# Altium project 48FE+2GE+2SFP.PrjPcb (part 6 of 9)

## Sheet 26_PP0_SSMII.SchDoc
size 419 x 296 mm; Author: Serbinov O.A.; CompanyName: ELSICOM; DrawnBy: Serbinov O.A.; Engineer: Serbinov O.A.; Organization: Elsicom; Address1: Kirova avenue, 58; Address2: Tomsk; Address3: Russia 634012; DocumentNumber: 27; SheetNumber: 27; SheetTotal: 44; ProjectName: 48_PORTS
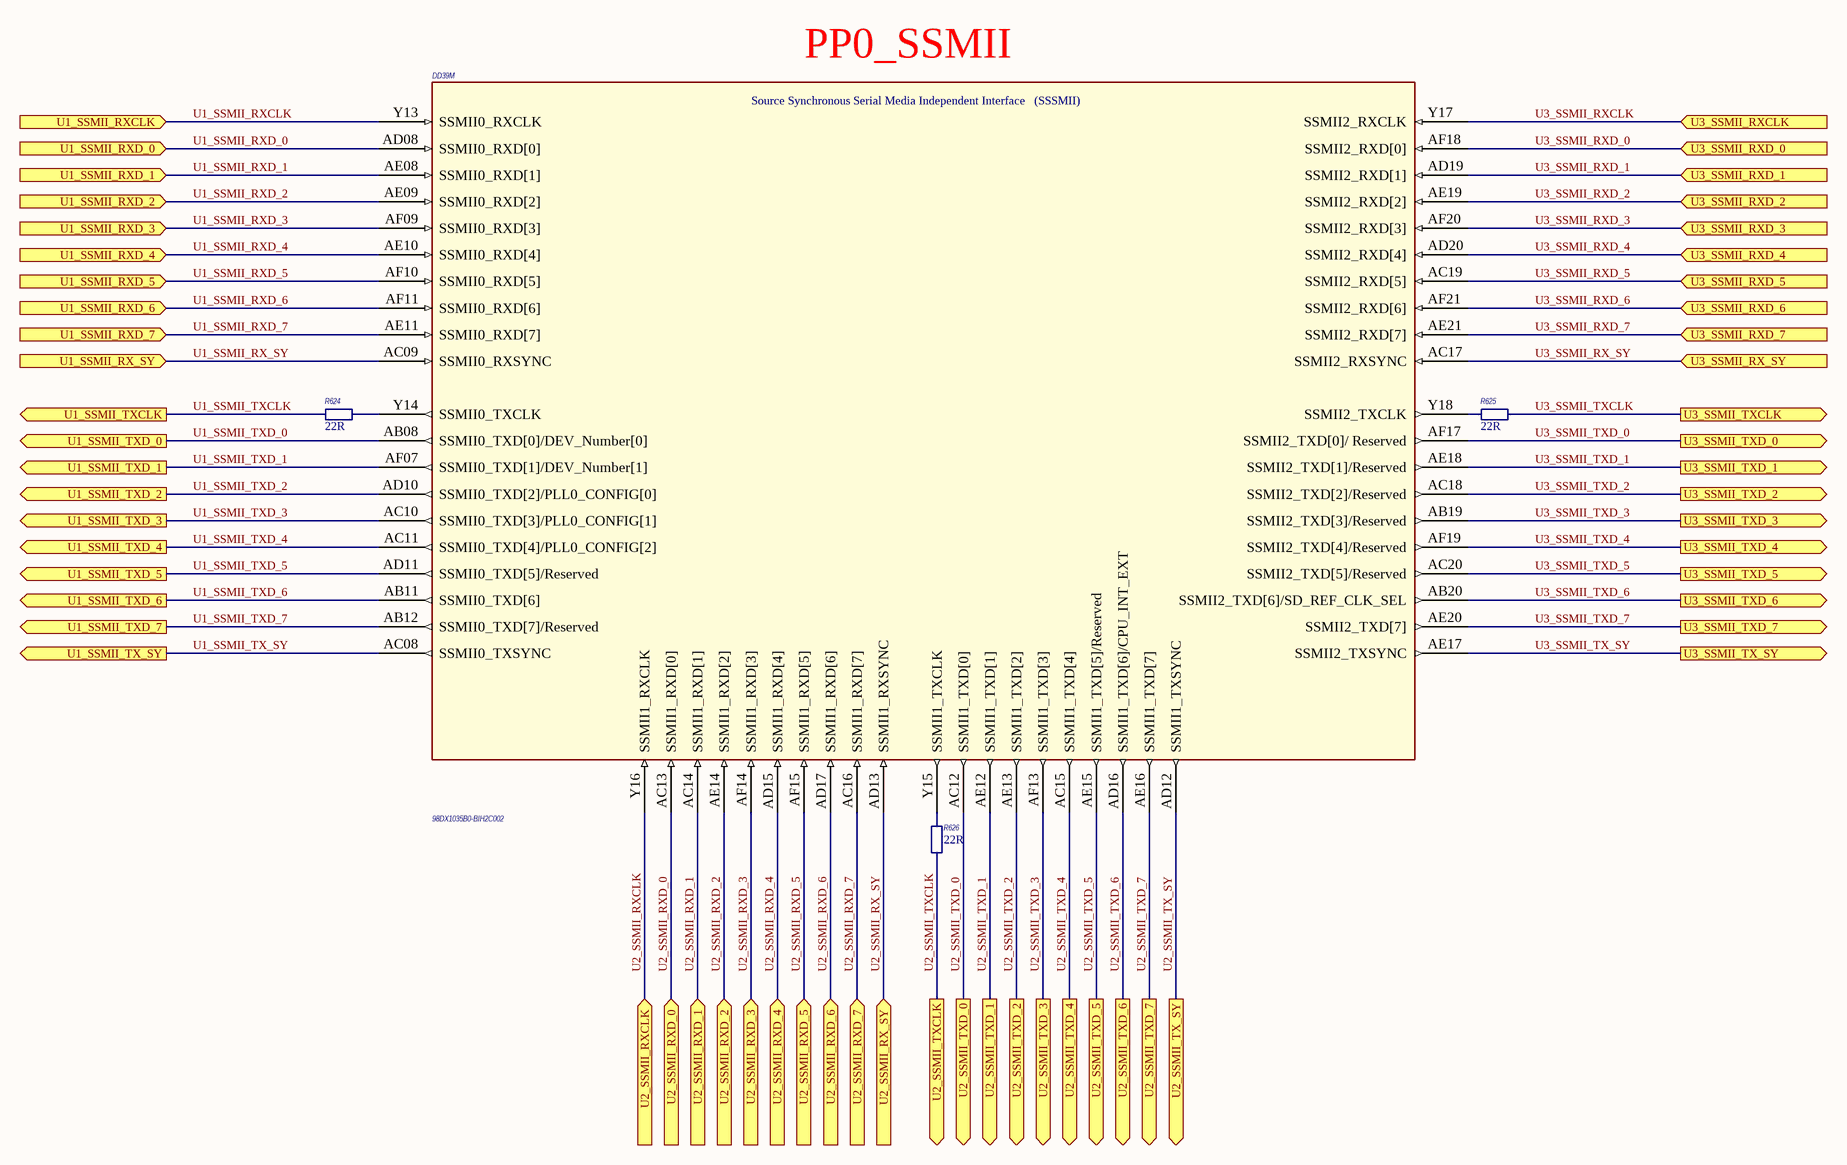
[diagram p14: 26_PP0_SSMII.SchDoc]

### Parts
DD39  98DX1035B0-BIH2C002  [HSBGA617_27X27_1MM]  (part M of 16)
R624  Resistance: 22R  [R0402_IPC High Density]  (hidden comment: ERJ-2RKF22R0X)
R625  Resistance: 22R  [R0402_IPC High Density]  (hidden comment: ERJ-2RKF22R0X)
R626  Resistance: 22R  [R0402_IPC High Density]  (hidden comment: ERJ-2RKF22R0X)

### Ports
U1_SSMII_RX_SY (in), U1_SSMII_RXCLK (in), U1_SSMII_RXD_0 (in), U1_SSMII_RXD_1 (in), U1_SSMII_RXD_2 (in), U1_SSMII_RXD_3 (in), U1_SSMII_RXD_4 (in), U1_SSMII_RXD_5 (in), U1_SSMII_RXD_6 (in), U1_SSMII_RXD_7 (in), U1_SSMII_TX_SY (out), U1_SSMII_TXCLK (out), U1_SSMII_TXD_0 (out), U1_SSMII_TXD_1 (out), U1_SSMII_TXD_2 (out), U1_SSMII_TXD_3 (out), U1_SSMII_TXD_4 (out), U1_SSMII_TXD_5 (out), U1_SSMII_TXD_6 (out), U1_SSMII_TXD_7 (out), U2_SSMII_RX_SY (in), U2_SSMII_RXCLK (in), U2_SSMII_RXD_0 (in), U2_SSMII_RXD_1 (in), U2_SSMII_RXD_2 (in), U2_SSMII_RXD_3 (in), U2_SSMII_RXD_4 (in), U2_SSMII_RXD_5 (in), U2_SSMII_RXD_6 (in), U2_SSMII_RXD_7 (in), U2_SSMII_TX_SY (out), U2_SSMII_TXCLK (out), U2_SSMII_TXD_0 (out), U2_SSMII_TXD_1 (out), U2_SSMII_TXD_2 (out), U2_SSMII_TXD_3 (out), U2_SSMII_TXD_4 (out), U2_SSMII_TXD_5 (out), U2_SSMII_TXD_6 (out), U2_SSMII_TXD_7 (out), U3_SSMII_RX_SY (in), U3_SSMII_RXCLK (in), U3_SSMII_RXD_0 (in), U3_SSMII_RXD_1 (in), U3_SSMII_RXD_2 (in), U3_SSMII_RXD_3 (in), U3_SSMII_RXD_4 (in), U3_SSMII_RXD_5 (in), U3_SSMII_RXD_6 (in), U3_SSMII_RXD_7 (in), U3_SSMII_TX_SY (out), U3_SSMII_TXCLK (out), U3_SSMII_TXD_0 (out), U3_SSMII_TXD_1 (out), U3_SSMII_TXD_2 (out), U3_SSMII_TXD_3 (out), U3_SSMII_TXD_4 (out), U3_SSMII_TXD_5 (out), U3_SSMII_TXD_6 (out), U3_SSMII_TXD_7 (out)

### Nets
U1_SSMII_RX_SY: DD39.AC09(SSMII0_RXSYNC) ; port U1_SSMII_RX_SY
U1_SSMII_RXCLK: DD39.Y13(SSMII0_RXCLK) ; port U1_SSMII_RXCLK
U1_SSMII_RXD_0: DD39.AD08(SSMII0_RXD[0]) ; port U1_SSMII_RXD_0
U1_SSMII_RXD_1: DD39.AE08(SSMII0_RXD[1]) ; port U1_SSMII_RXD_1
U1_SSMII_RXD_2: DD39.AE09(SSMII0_RXD[2]) ; port U1_SSMII_RXD_2
U1_SSMII_RXD_3: DD39.AF09(SSMII0_RXD[3]) ; port U1_SSMII_RXD_3
U1_SSMII_RXD_4: DD39.AE10(SSMII0_RXD[4]) ; port U1_SSMII_RXD_4
U1_SSMII_RXD_5: DD39.AF10(SSMII0_RXD[5]) ; port U1_SSMII_RXD_5
U1_SSMII_RXD_6: DD39.AF11(SSMII0_RXD[6]) ; port U1_SSMII_RXD_6
U1_SSMII_RXD_7: DD39.AE11(SSMII0_RXD[7]) ; port U1_SSMII_RXD_7
U1_SSMII_TX_SY: DD39.AC08(SSMII0_TXSYNC) ; port U1_SSMII_TX_SY
U1_SSMII_TXCLK: R624.2 ; port U1_SSMII_TXCLK
U1_SSMII_TXD_0: DD39.AB08(SSMII0_TXD[0]/DEV_Number[0]) ; port U1_SSMII_TXD_0
U1_SSMII_TXD_1: DD39.AF07(SSMII0_TXD[1]/DEV_Number[1]) ; port U1_SSMII_TXD_1
U1_SSMII_TXD_2: DD39.AD10(SSMII0_TXD[2]/PLL0_CONFIG[0]) ; port U1_SSMII_TXD_2
U1_SSMII_TXD_3: DD39.AC10(SSMII0_TXD[3]/PLL0_CONFIG[1]) ; port U1_SSMII_TXD_3
U1_SSMII_TXD_4: DD39.AC11(SSMII0_TXD[4]/PLL0_CONFIG[2]) ; port U1_SSMII_TXD_4
U1_SSMII_TXD_5: DD39.AD11(SSMII0_TXD[5]/Reserved) ; port U1_SSMII_TXD_5
U1_SSMII_TXD_6: DD39.AB11(SSMII0_TXD[6]) ; port U1_SSMII_TXD_6
U1_SSMII_TXD_7: DD39.AB12(SSMII0_TXD[7]/Reserved) ; port U1_SSMII_TXD_7
U2_SSMII_RX_SY: DD39.AD13(SSMII1_RXSYNC) ; port U2_SSMII_RX_SY
U2_SSMII_RXCLK: DD39.Y16(SSMII1_RXCLK) ; port U2_SSMII_RXCLK
U2_SSMII_RXD_0: DD39.AC13(SSMII1_RXD[0]) ; port U2_SSMII_RXD_0
U2_SSMII_RXD_1: DD39.AC14(SSMII1_RXD[1]) ; port U2_SSMII_RXD_1
U2_SSMII_RXD_2: DD39.AE14(SSMII1_RXD[2]) ; port U2_SSMII_RXD_2
U2_SSMII_RXD_3: DD39.AF14(SSMII1_RXD[3]) ; port U2_SSMII_RXD_3
U2_SSMII_RXD_4: DD39.AD15(SSMII1_RXD[4]) ; port U2_SSMII_RXD_4
U2_SSMII_RXD_5: DD39.AF15(SSMII1_RXD[5]) ; port U2_SSMII_RXD_5
U2_SSMII_RXD_6: DD39.AD17(SSMII1_RXD[6]) ; port U2_SSMII_RXD_6
U2_SSMII_RXD_7: DD39.AC16(SSMII1_RXD[7]) ; port U2_SSMII_RXD_7
U2_SSMII_TX_SY: DD39.AD12(SSMII1_TXSYNC) ; port U2_SSMII_TX_SY
U2_SSMII_TXCLK: R626.2 ; port U2_SSMII_TXCLK
U2_SSMII_TXD_0: DD39.AC12(SSMII1_TXD[0]) ; port U2_SSMII_TXD_0
U2_SSMII_TXD_1: DD39.AE12(SSMII1_TXD[1]) ; port U2_SSMII_TXD_1
U2_SSMII_TXD_2: DD39.AE13(SSMII1_TXD[2]) ; port U2_SSMII_TXD_2
U2_SSMII_TXD_3: DD39.AF13(SSMII1_TXD[3]) ; port U2_SSMII_TXD_3
U2_SSMII_TXD_4: DD39.AC15(SSMII1_TXD[4]) ; port U2_SSMII_TXD_4
U2_SSMII_TXD_5: DD39.AE15(SSMII1_TXD[5]/Reserved) ; port U2_SSMII_TXD_5
U2_SSMII_TXD_6: DD39.AD16(SSMII1_TXD[6]/CPU_INT_EXT) ; port U2_SSMII_TXD_6
U2_SSMII_TXD_7: DD39.AE16(SSMII1_TXD[7]) ; port U2_SSMII_TXD_7
U3_SSMII_RX_SY: DD39.AC17(SSMII2_RXSYNC) ; port U3_SSMII_RX_SY
U3_SSMII_RXCLK: DD39.Y17(SSMII2_RXCLK) ; port U3_SSMII_RXCLK
U3_SSMII_RXD_0: DD39.AF18(SSMII2_RXD[0]) ; port U3_SSMII_RXD_0
U3_SSMII_RXD_1: DD39.AD19(SSMII2_RXD[1]) ; port U3_SSMII_RXD_1
U3_SSMII_RXD_2: DD39.AE19(SSMII2_RXD[2]) ; port U3_SSMII_RXD_2
U3_SSMII_RXD_3: DD39.AF20(SSMII2_RXD[3]) ; port U3_SSMII_RXD_3
U3_SSMII_RXD_4: DD39.AD20(SSMII2_RXD[4]) ; port U3_SSMII_RXD_4
U3_SSMII_RXD_5: DD39.AC19(SSMII2_RXD[5]) ; port U3_SSMII_RXD_5
U3_SSMII_RXD_6: DD39.AF21(SSMII2_RXD[6]) ; port U3_SSMII_RXD_6
U3_SSMII_RXD_7: DD39.AE21(SSMII2_RXD[7]) ; port U3_SSMII_RXD_7
U3_SSMII_TX_SY: DD39.AE17(SSMII2_TXSYNC) ; port U3_SSMII_TX_SY
U3_SSMII_TXCLK: R625.1 ; port U3_SSMII_TXCLK
U3_SSMII_TXD_0: DD39.AF17(SSMII2_TXD[0]/_Reserved) ; port U3_SSMII_TXD_0
U3_SSMII_TXD_1: DD39.AE18(SSMII2_TXD[1]/Reserved) ; port U3_SSMII_TXD_1
U3_SSMII_TXD_2: DD39.AC18(SSMII2_TXD[2]/Reserved) ; port U3_SSMII_TXD_2
U3_SSMII_TXD_3: DD39.AB19(SSMII2_TXD[3]/Reserved) ; port U3_SSMII_TXD_3
U3_SSMII_TXD_4: DD39.AF19(SSMII2_TXD[4]/Reserved) ; port U3_SSMII_TXD_4
U3_SSMII_TXD_5: DD39.AC20(SSMII2_TXD[5]/Reserved) ; port U3_SSMII_TXD_5
U3_SSMII_TXD_6: DD39.AB20(SSMII2_TXD[6]/SD_REF_CLK_SEL) ; port U3_SSMII_TXD_6
U3_SSMII_TXD_7: DD39.AE20(SSMII2_TXD[7]) ; port U3_SSMII_TXD_7
NetDD39_Y14: DD39.Y14(SSMII0_TXCLK) R624.1
NetDD39_Y15: DD39.Y15(SSMII1_TXCLK) R626.1
NetDD39_Y18: DD39.Y18(SSMII2_TXCLK) R625.2

### Notes on the sheet
- (near DD39) PP0_SSMII
- A3
- SIZE
- PROJECT
- SHEET
- OF
- Engineer: Oleg Serbinov
- (in symbol 98DX1035A1-BIH2C002, part M) Source Synchronous Serial Media Independent Interface   (SSSMII)

### Library data of the parts
DD39 = 98DX1035A1-BIH2C002: IC 24-PORT FE  4-PORT 2.5GE L2 ENTRY-LEVEL, CPU; Customer Part Number: Микросхема, 98DX1035B0-BIH2C002, IC 24-PORT FE 4-PORT 2.5GE L2 ENTRY-LEVEL, HSBGA617SBGA617; Manufacturer: Marvell Technology Group; Manufacturer Part Number: 98DX1035B0-BIH2C002
R624-R626 = ERJ-2RKF22R0X: R0402, 22R 1%; Manufacturer: Panasonic; Rpart number: RC0402FR-0749R9L ; RC1005F49R9CS ; MCR01MRTF49R9 ; CRCW040249R9FKED ; CR0402-FX-49R9GLF ; RC-02W220FT; Rmanufacturer: Yageo  Samsung  Stackpole Electronics  Rohm Semiconductor  Vishay Dale; Customer Part Number: Резистор, 22R, 0402, 1%; Power Rating: 100; Voltage Rating: 50; Temperature Coefficient: ± 100; Resistor Element Material: Thick Film; Resistor Case Style: 0402; Resistor Mounting: SMD; Analogs: any suitable; Supplier 1: Farnell; Supplier Part Number 1: 2059106; RoHS 1: YES; Stock 1: 10948; Pricing 1: 50=0.016, 100=0.012, 500=0.006, 1000=0.004 (GBP); Resistance Tolerance: ± 1%; ComponentLink1URL: http://www.farnell.com/datasheets/426256.pdf; ComponentLink1Description: http://www.farnell.com/datasheets/426256.pdf; Supplier: Farnell; RoHS: YES; Manufacturer Part Number: ERJ-2RKF22R0X; Supplier Part Number: 2059106; Pricing: 50=0.016, 100=0.012, 500=0.006, 1000=0.004 (GBP)

## Sheet 27_PP0_GPP, SPI.SchDoc
size 419 x 296 mm; Author: Serbinov O.A.; CompanyName: ELSICOM; DrawnBy: Serbinov O.A.; Engineer: Serbinov O.A.; Organization: Elsicom; Address1: Kirova avenue, 58; Address2: Tomsk; Address3: Russia 634012; DocumentNumber: 28; SheetNumber: 28; SheetTotal: 44; ProjectName: 48_PORTS
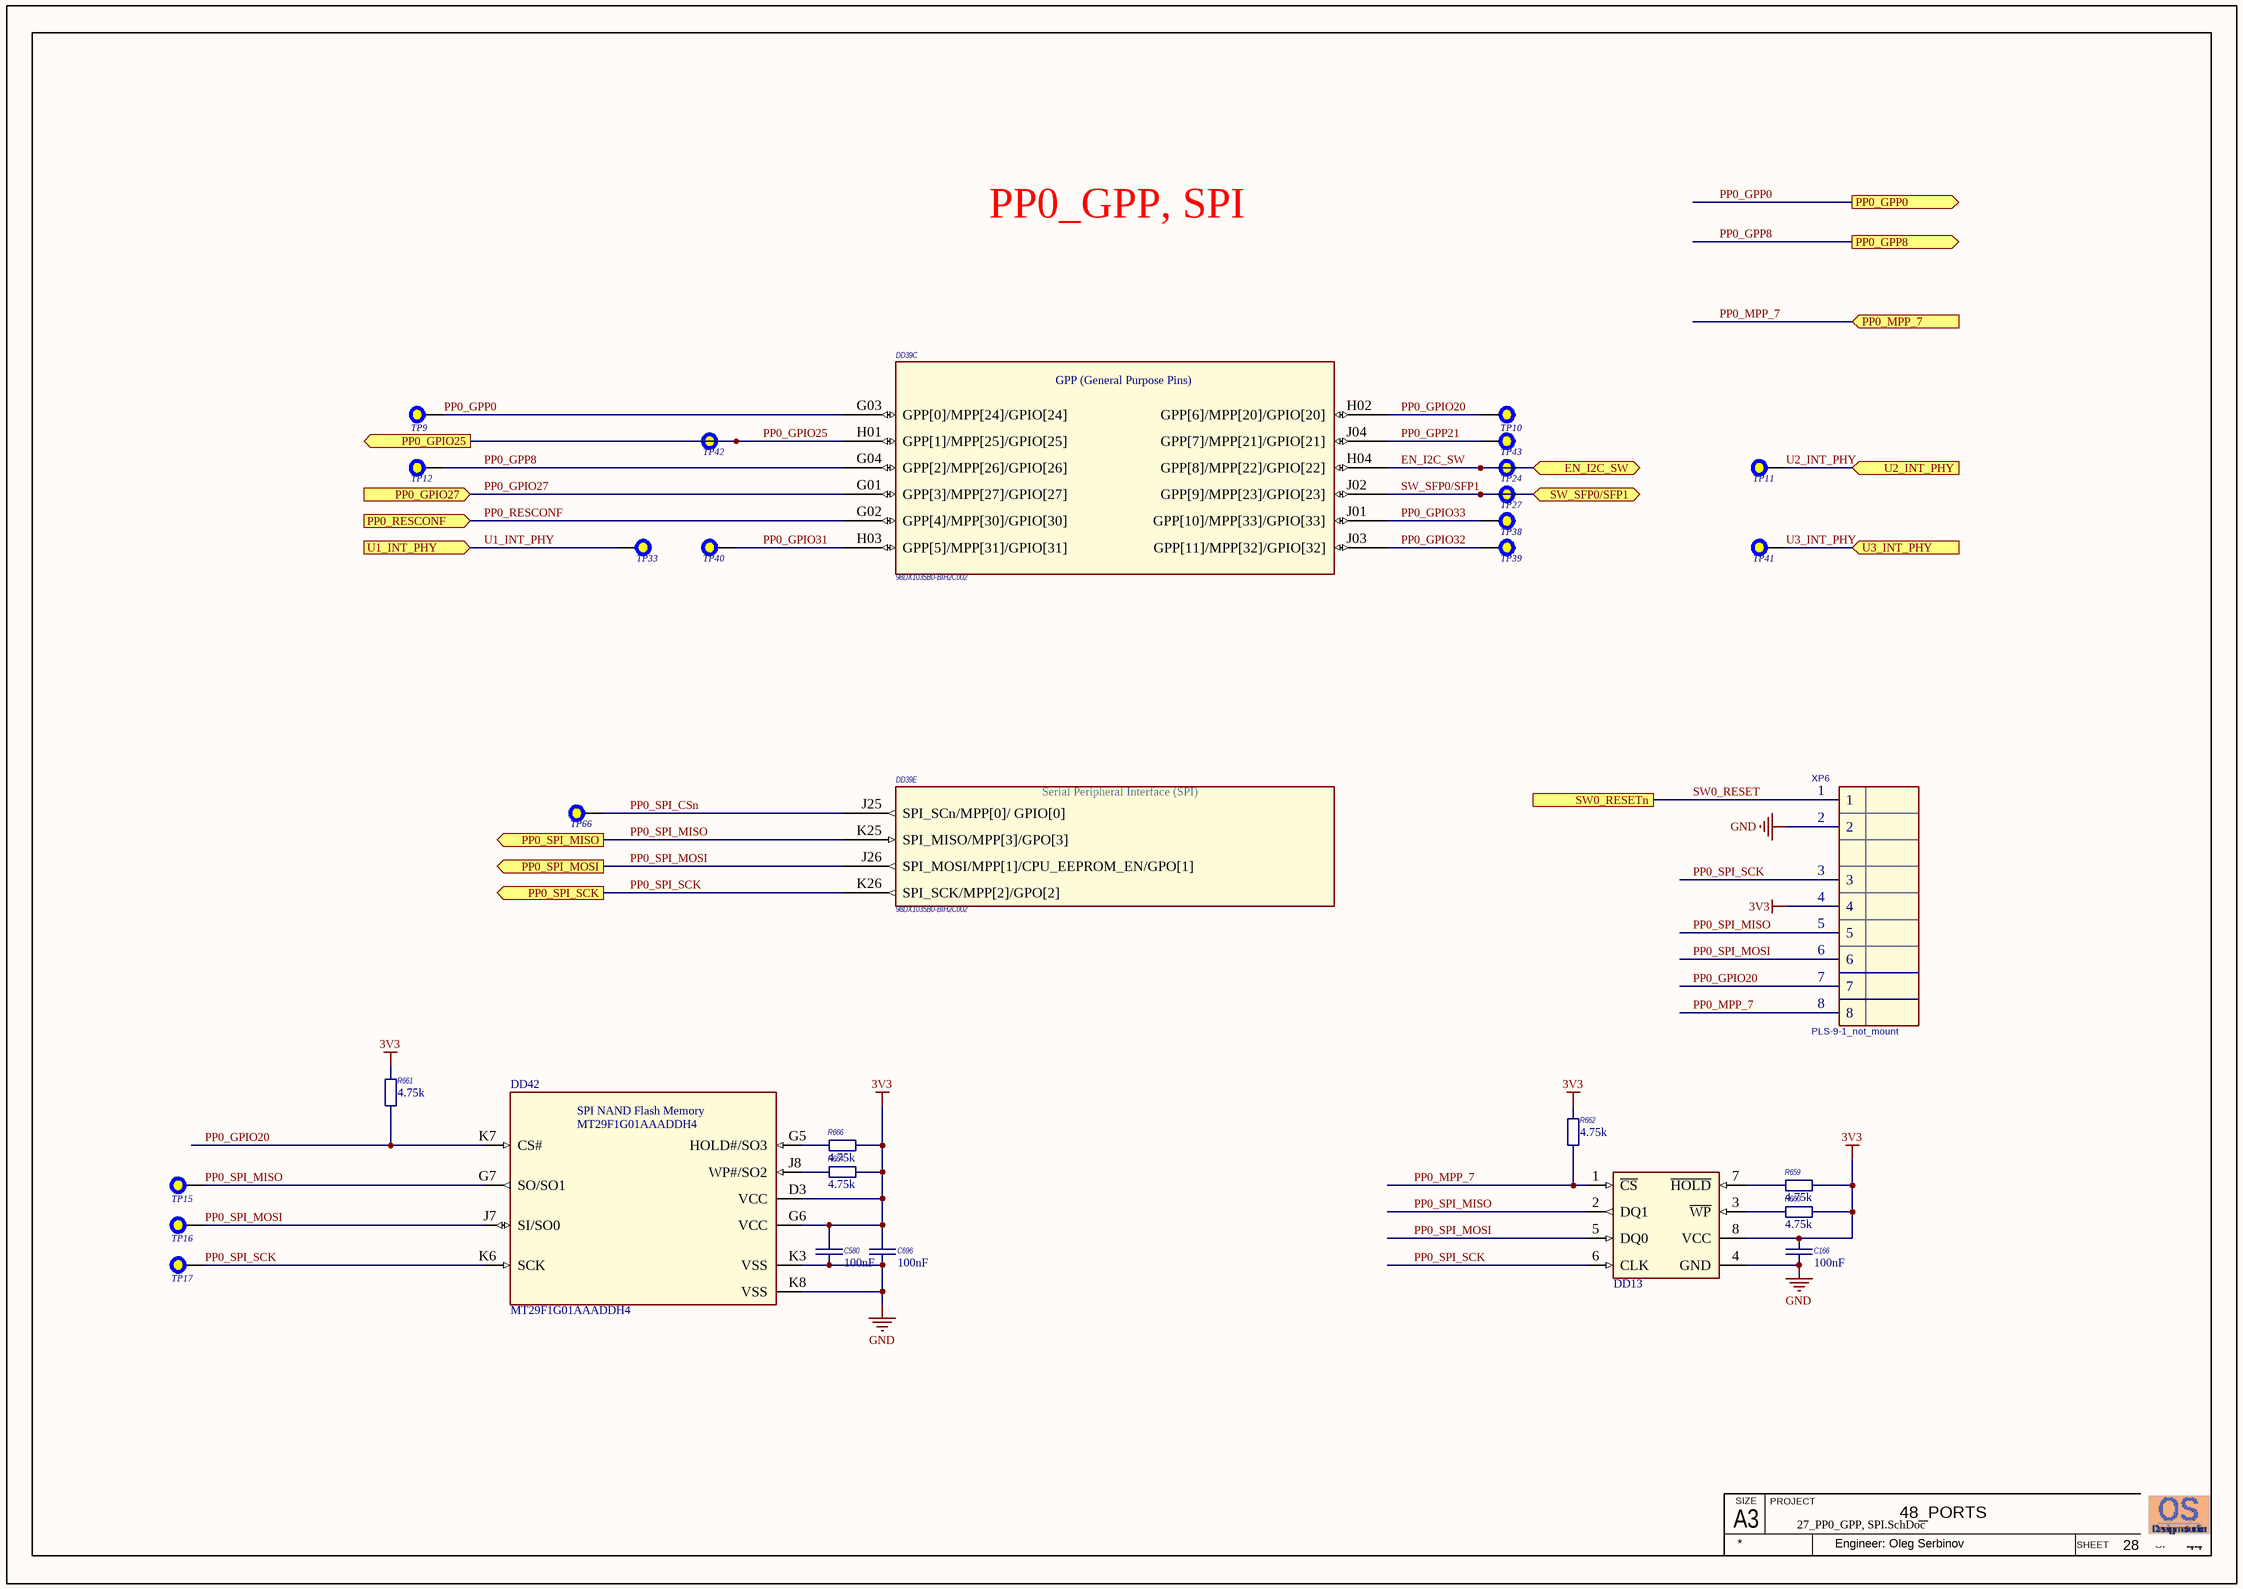
[diagram p15: 27_PP0_GPP, SPI.SchDoc]

### Parts
C166  Capacitance: 100nF  [C0402_IPC High Density]  (hidden comment: GRM155R71E104KE14D)
C580  Capacitance: 100nF  [C0402_IPC High Density]  (hidden comment: GRM155R71E104KE14D)
C696  Capacitance: 100nF  [C0402_IPC High Density]  (hidden comment: GRM155R71E104KE14D)
DD13  M25P16-VMN6P  [SO-8_L]  (value not drawn)
DD39  98DX1035B0-BIH2C002  [HSBGA617_27X27_1MM]  (parts C,E of 16)
DD42  MT29F1G01AAADDH4  [VFBGA 63-Ball]
R659  Resistance (Ohms): 4.75k  [R0402_IPC High Density]  (hidden comment: ERJ-2RKF4751X)
R660  Resistance (Ohms): 4.75k  [R0402_IPC High Density]  (hidden comment: ERJ-2RKF4751X)
R661  Resistance (Ohms): 4.75k  [R0402_IPC High Density]  (hidden comment: ERJ-2RKF4751X)
R662  Resistance (Ohms): 4.75k  [R0402_IPC High Density]  (hidden comment: ERJ-2RKF4751X)
R664  Resistance (Ohms): 4.75k  [R0402_IPC High Density]  (hidden comment: ERJ-2RKF4751X)
R666  Resistance (Ohms): 4.75k  [R0402_IPC High Density]  (hidden comment: ERJ-2RKF4751X)
TP9  Test Point 0.5mm pad  [Test Point 0.5mm]  (value not drawn)  (no BOM)
TP10  Test Point 0.5mm pad  [Test Point 0.5mm]  (value not drawn)  (no BOM)
TP11  Test Point 0.5mm pad  [Test Point 0.5mm]  (value not drawn)  (no BOM)
TP12  Test Point 0.5mm pad  [Test Point 0.5mm]  (value not drawn)  (no BOM)
TP15  Test Point 0.5mm pad  [Test Point 0.5mm]  (value not drawn)  (no BOM)
TP16  Test Point 0.5mm pad  [Test Point 0.5mm]  (value not drawn)  (no BOM)
TP17  Test Point 0.5mm pad  [Test Point 0.5mm]  (value not drawn)  (no BOM)
TP24  Test Point 0.5mm pad  [Test Point 0.5mm]  (value not drawn)  (no BOM)
TP27  Test Point 0.5mm pad  [Test Point 0.5mm]  (value not drawn)  (no BOM)
TP33  Test Point 0.5mm pad  [Test Point 0.5mm]  (value not drawn)  (no BOM)
TP38  Test Point 0.5mm pad  [Test Point 0.5mm]  (value not drawn)  (no BOM)
TP39  Test Point 0.5mm pad  [Test Point 0.5mm]  (value not drawn)  (no BOM)
TP40  Test Point 0.5mm pad  [Test Point 0.5mm]  (value not drawn)  (no BOM)
TP41  Test Point 0.5mm pad  [Test Point 0.5mm]  (value not drawn)  (no BOM)
TP42  Test Point 0.5mm pad  [Test Point 0.5mm]  (value not drawn)  (no BOM)
TP43  Test Point 0.5mm pad  [Test Point 0.5mm]  (value not drawn)  (no BOM)
TP66  Test Point 0.5mm pad  [Test Point 0.5mm]  (value not drawn)  (no BOM)
XP6  PLS-9-1_not_mount  [PLS-9-1]

### Ports
EN_I2C_SW (bidir), PP0_GPIO25 (out), PP0_GPIO27 (in), PP0_GPP0 (out), PP0_GPP8 (out), PP0_MPP_7 (in), PP0_RESCONF (in), PP0_SPI_MISO (out), PP0_SPI_MOSI (out), PP0_SPI_SCK (out), SW0_RESETn, SW_SFP0/SFP1 (bidir), U1_INT_PHY (in), U2_INT_PHY (in), U3_INT_PHY (in)

### Nets
3V3: C166.1 C580.1 C696.1 DD13.8(VCC) DD42.D3(VСС) DD42.G6(VCC) R659.2 R660.2 R661.1 R662.1 R664.1 R666.1 XP6.4
GND: C166.2 C580.2 C696.2 DD13.4(GND) DD42.K3(VSS) DD42.K8(VSS) XP6.2
EN_I2C_SW: DD39.H04(GPP[8]/MPP[22]/GPIO[22]) TP24.1 ; port EN_I2C_SW
PP0_GPIO20: DD39.H02(GPP[6]/MPP[20]/GPIO[20]) DD42.K7(CS#) R661.2 TP10.1 XP6.7
PP0_GPIO25: DD39.H01(GPP[1]/MPP[25]/GPIO[25]) TP42.1 ; port PP0_GPIO25
PP0_GPIO27: DD39.G01(GPP[3]/MPP[27]/GPIO[27]) ; port PP0_GPIO27
PP0_GPIO31: DD39.H03(GPP[5]/MPP[31]/GPIO[31]) TP40.1
PP0_GPIO32: DD39.J03(GPP[11]/MPP[32]/GPIO[32]) TP39.1
PP0_GPIO33: DD39.J01(GPP[10]/MPP[33]/GPIO[33]) TP38.1
PP0_GPP0: DD39.G03(GPP[0]/MPP[24]/GPIO[24]) TP9.1 ; port PP0_GPP0
PP0_GPP8: DD39.G04(GPP[2]/MPP[26]/GPIO[26]) TP12.1 ; port PP0_GPP8
PP0_GPP21: DD39.J04(GPP[7]/MPP[21]/GPIO[21]) TP43.1
PP0_MPP_7: DD13.1(~{CS}) R662.2 XP6.8 ; port PP0_MPP_7
PP0_RESCONF: DD39.G02(GPP[4]/MPP[30]/GPIO[30]) ; port PP0_RESCONF
PP0_SPI_CSn: DD39.J25(SPI_SCn/MPP[0]/_GPIO[0]) TP66.1
PP0_SPI_MISO: DD13.2(DQ1) DD39.K25(SPI_MISO/MPP[3]/GPO[3]) DD42.G7(SO/SO1) TP15.1 XP6.5 ; port PP0_SPI_MISO
PP0_SPI_MOSI: DD13.5(DQ0) DD39.J26(SPI_MOSI/MPP[1]/CPU_EEPROM_EN/GPO[1]) DD42.J7(SI/SO0) TP16.1 XP6.6 ; port PP0_SPI_MOSI
PP0_SPI_SCK: DD13.6(CLK) DD39.K26(SPI_SCK/MPP[2]/GPO[2]) DD42.K6(SCK) TP17.1 XP6.3 ; port PP0_SPI_SCK
SW0_RESET: XP6.1 ; port SW0_RESETn
SW_SFP0/SFP1: DD39.J02(GPP[9]/MPP[23]/GPIO[23]) TP27.1 ; port SW_SFP0/SFP1
U1_INT_PHY: TP33.1 ; port U1_INT_PHY
U2_INT_PHY: TP11.1 ; port U2_INT_PHY
U3_INT_PHY: TP41.1 ; port U3_INT_PHY
NetDD13_3: DD13.3(~{WP}) R660.1
NetDD13_7: DD13.7(~{HOLD}) R659.1
NetDD42_G5: DD42.G5(HOLD#/SO3) R666.2
NetDD42_J8: DD42.J8(WP#/SO2) R664.2

### Notes on the sheet
- PP0_GPP, SPI
- A3
- SIZE
- PROJECT
- SHEET
- OF
- Engineer: Oleg Serbinov
- (in symbol 98DX1035A1-BIH2C002, part C) GPP (General Purpose Pins)
- (in symbol 98DX1035A1-BIH2C002, part E) Serial Peripheral Interface (SPI)
- (in symbol MT29F1G01AAADDH4) SPI NAND Flash Memory

### Library data of the parts
C166 C580 C696 = GRM155R71E104KE14D: as C330-C361 on sheet 17_FE_PORT_17-24; Manufacturer Part Number: GRM155R71E104KE14D; RoHS: YES; Packaging: Reel; Package / Case: 0402; ComponentLink1URL: http://www.farnell.com/datasheets/4360.pdf; ComponentLink1Description: http://www.farnell.com/datasheets/4360.pdf; Pricing: 10000=0.008593, 30000=0.007991 (GBP); Supplier 1: Farnell; Supplier Part Number 1: 1118151; Stock: 3; Dielectric Characteristic: X7R; Operating Temperature Min: -55; Operating Temperature Max: 125; Operating Temperature Range: -55°C to +125; Series: GRM Hi-Cap; Terminal Type: Surface Mount (SMD, SMT); Tolerance -: 10%; Voltage Rating V DC: 16
DD13 = M25P16-VMN6P: NOR Flash Serial-SPI 3.3V 16Mbit 2M x 8bit 1 8-Pin SO N; Customer Part Number: Микросхема, M25P16-VMN6P, IC FLASH 16MBIT 75MHZ, 8-SO; Manufacturer: Micron Technology Inc.; Manufacturer Part Number: M25P16-VMN6P
DD39 = 98DX1035A1-BIH2C002: as DD39 on sheet 26_PP0_SSMII; Manufacturer Part Number: 98DX1035B0-BIH2C002
DD42 = MT29F1G01AAADDH4: IC 1Gb x1: SPI NAND Flash Memory; Manufacturer: Micron Technology Inc; Customer Part Number: Микросхема, MT29F1G01AAADDH4, IC FLASH 1GBIT, 63-VFBGA; Description 1: IC FLASH SRL NAND 1GB 63VFBGA; Category 1: Integrated Circuits (ICs); Memory Type: FLASH - NAND; Memory Size: 1G (1G x 1); Interface: SPI Serial; Voltage - Supply: 2.7 V ~ 3.6 V; Supplier 1: Digi-Key; Supplier Part Number 1: MT29F1G01AAADDH4:D-ND; RoHS 1: RoHS Compliant; Stock 1: 0; Pricing 1: 1000=3.08246 (USD); Format - Memory: FLASH; Speed: -; Operating Temperature: 0°C ~ 70°C; Package / Case: 63-VFBGA; Supplier Device Package: 63-VFBGA (9x11); Packaging: Bulk; Category: Integrated Circuits (ICs); Supplier: Digi-Key; Supplier Part Number: MT29F1G01AAADDH4:D-ND; RoHS: RoHS Compliant; Manufacturer Part Number: MT29F1G01AAADDH4
R659-R662 R664 R666 = ERJ-2RKF4751X: as R611-R614 on sheet 22_PHY_GE_PP1; Tolerance: ±1%; Packaging: Cut Tape (CT); Package / Case: 0402 (1005 Metric); Category: Resistors; Manufacturer Part Number: ERJ-2RKF4751X; Supplier Part Number: P4.75KLCT-ND; RoHS: RoHS Compliant; Supplier: Digi-Key; ComponentLink1URL: http://industrial.panasonic.com/www-cgi/jvcr13pz.cgi?E+PZ+3+AOA0002+ERJ2RKF4751X+7+WW; ComponentLink1Description: http://industrial.panasonic.com/www-cgi/jvcr13pz.cgi?E+PZ+3+AOA0002+ERJ2RKF4751X+7+WW; Features: -; Composition: Thick Film; Height: 0.016" (0.40mm); Number of Terminations: 2; Supplier Device Package: 0402; Size / Dimension: 0.039" L x 0.020" W (1.00mm x 0.50mm)
XP6 = PLS-9-1_not_mount: Connector PLS-9 (pin 3 is removed); Customer Part Number: Разъем, PLS-9-1, 9 Positions Header pin 3 is removed,  2.54mm Through Hole Tin-Lead; Analogs: any suitable; Manufacturer Part Number: PLS-9-1_not_mount; Notes: not_mount

## Sheet 28_PP0_SGMII, LED, TWSI.SchDoc
size 419 x 296 mm; Author: Serbinov O.A.; CompanyName: ELSICOM; DrawnBy: Serbinov O.A.; Engineer: Serbinov O.A.; Organization: Elsicom; Address1: Kirova avenue, 58; Address2: Tomsk; Address3: Russia 634012; DocumentNumber: 29; SheetNumber: 29; SheetTotal: 44; ProjectName: 48_PORTS
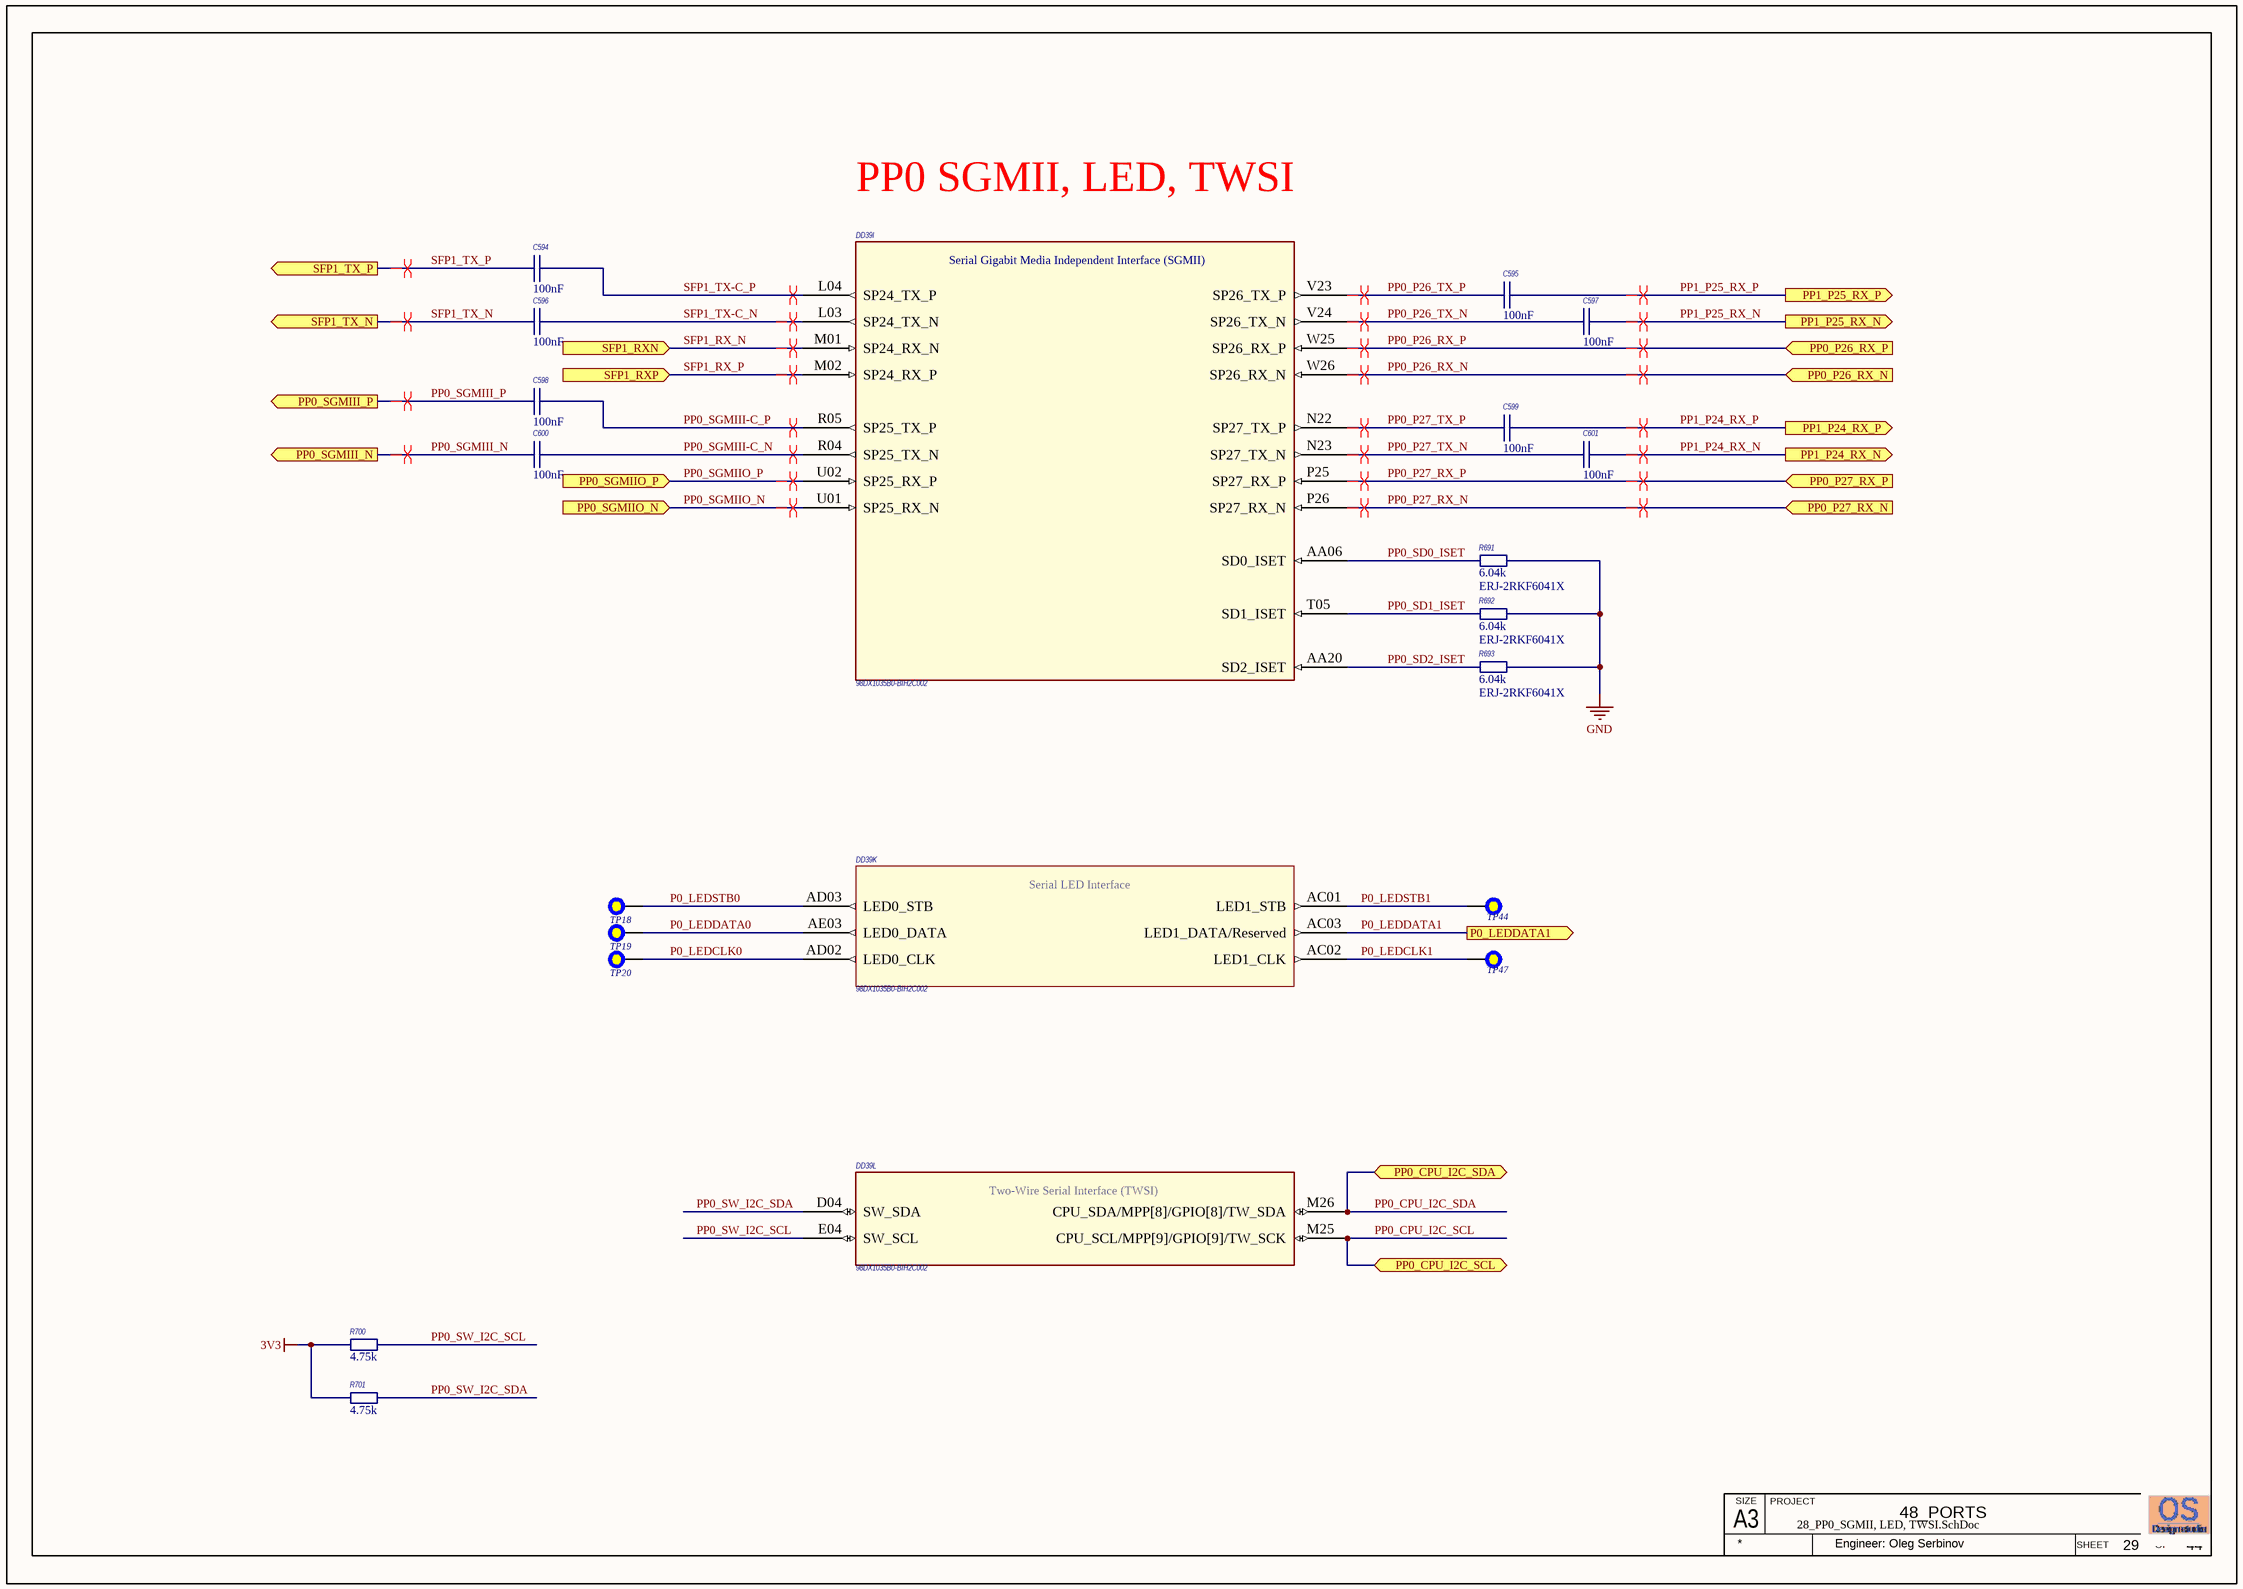
[diagram p16: 28_PP0_SGMII, LED, TWSI.SchDoc]

### Parts
C594  Capacitance: 100nF  [C0402_IPC High Density]  (hidden comment: GRM155R71E104KE14D)
C595  Capacitance: 100nF  [C0402_IPC High Density]  (hidden comment: GRM155R71E104KE14D)
C596  Capacitance: 100nF  [C0402_IPC High Density]  (hidden comment: GRM155R71E104KE14D)
C597  Capacitance: 100nF  [C0402_IPC High Density]  (hidden comment: GRM155R71E104KE14D)
C598  Capacitance: 100nF  [C0402_IPC High Density]  (hidden comment: GRM155R71E104KE14D)
C599  Capacitance: 100nF  [C0402_IPC High Density]  (hidden comment: GRM155R71E104KE14D)
C600  Capacitance: 100nF  [C0402_IPC High Density]  (hidden comment: GRM155R71E104KE14D)
C601  Capacitance: 100nF  [C0402_IPC High Density]  (hidden comment: GRM155R71E104KE14D)
DD39  98DX1035B0-BIH2C002  [HSBGA617_27X27_1MM]  (parts I,K,L of 16)
R691  Resistance (Ohms): 6.04k  [R0402_IPC High Density]  (hidden comment: ERJ-2RKF6041X)
R692  Resistance (Ohms): 6.04k  [R0402_IPC High Density]  (hidden comment: ERJ-2RKF6041X)
R693  Resistance (Ohms): 6.04k  [R0402_IPC High Density]  (hidden comment: ERJ-2RKF6041X)
R700  Resistance (Ohms): 4.75k  [R0402_IPC High Density]  (hidden comment: ERJ-2RKF4751X)
R701  Resistance (Ohms): 4.75k  [R0402_IPC High Density]  (hidden comment: ERJ-2RKF4751X)
TP18  Test Point 0.5mm pad  [Test Point 0.5mm]  (value not drawn)  (no BOM)
TP19  Test Point 0.5mm pad  [Test Point 0.5mm]  (value not drawn)  (no BOM)
TP20  Test Point 0.5mm pad  [Test Point 0.5mm]  (value not drawn)  (no BOM)
TP44  Test Point 0.5mm pad  [Test Point 0.5mm]  (value not drawn)  (no BOM)
TP47  Test Point 0.5mm pad  [Test Point 0.5mm]  (value not drawn)  (no BOM)

### Ports
P0_LEDDATA1 (out), PP0_CPU_I2C_SCL (bidir), PP0_CPU_I2C_SDA (bidir), PP0_P26_RX_N (in), PP0_P26_RX_P (in), PP0_P27_RX_N (in), PP0_P27_RX_P (in), PP0_SGMIII_N (out), PP0_SGMIII_P (out), PP0_SGMIIO_N (in), PP0_SGMIIO_P (in), PP1_P24_RX_N (out), PP1_P24_RX_P (out), PP1_P25_RX_N (out), PP1_P25_RX_P (out), SFP1_RXN (in), SFP1_RXP (in), SFP1_TX_N (out), SFP1_TX_P (out)

### Nets
3V3: R700.1 R701.1
GND: R691.2 R692.2 R693.2
P0_LEDCLK0: DD39.AD02(LED0_CLK) TP20.1
P0_LEDCLK1: DD39.AC02(LED1_CLK) TP47.1
P0_LEDDATA0: DD39.AE03(LED0_DATA) TP19.1
P0_LEDDATA1: DD39.AC03(LED1_DATA/Reserved) ; port P0_LEDDATA1
P0_LEDSTB0: DD39.AD03(LED0_STB) TP18.1
P0_LEDSTB1: DD39.AC01(LED1_STB) TP44.1
PP0_CPU_I2C_SCL: DD39.M25(CPU_SCL/MPP[9]/GPIO[9]/TW_SCK) ; port PP0_CPU_I2C_SCL
PP0_CPU_I2C_SDA: DD39.M26(CPU_SDA/MPP[8]/GPIO[8]/TW_SDA) ; port PP0_CPU_I2C_SDA
PP0_P26_RX_N: DD39.W26(SP26_RX_N) ; port PP0_P26_RX_N
PP0_P26_RX_P: DD39.W25(SP26_RX_P) ; port PP0_P26_RX_P
PP0_P26_TX_N: C597.2 DD39.V24(SP26_TX_N)
PP0_P26_TX_P: C595.2 DD39.V23(SP26_TX_P)
PP0_P27_RX_N: DD39.P26(SP27_RX_N) ; port PP0_P27_RX_N
PP0_P27_RX_P: DD39.P25(SP27_RX_P) ; port PP0_P27_RX_P
PP0_P27_TX_N: C601.2 DD39.N23(SP27_TX_N)
PP0_P27_TX_P: C599.2 DD39.N22(SP27_TX_P)
PP0_SD0_ISET: DD39.AA06(SD0_ISET) R691.1
PP0_SD1_ISET: DD39.T05(SD1_ISET) R692.1
PP0_SD2_ISET: DD39.AA20(SD2_ISET) R693.1
PP0_SGMIII-С_N: C600.1 DD39.R04(SP25_TX_N)
PP0_SGMIII-С_P: C598.1 DD39.R05(SP25_TX_P)
PP0_SGMIII_N: C600.2 ; port PP0_SGMIII_N
PP0_SGMIII_P: C598.2 ; port PP0_SGMIII_P
PP0_SGMIIO_N: DD39.U01(SP25_RX_N) ; port PP0_SGMIIO_N
PP0_SGMIIO_P: DD39.U02(SP25_RX_P) ; port PP0_SGMIIO_P
PP0_SW_I2C_SCL: DD39.E04(SW_SCL) R700.2
PP0_SW_I2C_SDA: DD39.D04(SW_SDA) R701.2
PP1_P24_RX_N: C601.1 ; port PP1_P24_RX_N
PP1_P24_RX_P: C599.1 ; port PP1_P24_RX_P
PP1_P25_RX_N: C597.1 ; port PP1_P25_RX_N
PP1_P25_RX_P: C595.1 ; port PP1_P25_RX_P
SFP1_RX_N: DD39.M01(SP24_RX_N) ; port SFP1_RXN
SFP1_RX_P: DD39.M02(SP24_RX_P) ; port SFP1_RXP
SFP1_TX-С_N: C596.1 DD39.L03(SP24_TX_N)
SFP1_TX-С_P: C594.1 DD39.L04(SP24_TX_P)
SFP1_TX_N: C596.2 ; port SFP1_TX_N
SFP1_TX_P: C594.2 ; port SFP1_TX_P

### Layout directives
differential pair: PP0_P26_RX_N, PP0_P26_RX_P, PP0_P26_TX_N, PP0_P26_TX_P, PP0_P27_RX_N, PP0_P27_RX_P, PP0_P27_TX_N, PP0_P27_TX_P, PP0_SGMIII-С_N, PP0_SGMIII-С_P, PP0_SGMIII_N, PP0_SGMIII_P, PP0_SGMIIO_N, PP0_SGMIIO_P, PP1_P24_RX_N, PP1_P24_RX_P, PP1_P25_RX_N, PP1_P25_RX_P, SFP1_RX_N, SFP1_RX_P, SFP1_TX-С_N, SFP1_TX-С_P, SFP1_TX_N, SFP1_TX_P

### Notes on the sheet
- PP0 SGMII, LED, TWSI
- A3
- SIZE
- PROJECT
- SHEET
- OF
- Engineer: Oleg Serbinov
- (in symbol 98DX1035A1-BIH2C002, part I) Serial Gigabit Media Independent Interface (SGMII)
- (in symbol 98DX1035A1-BIH2C002, part K) Serial LED Interface
- (in symbol 98DX1035A1-BIH2C002, part L) Two-Wire Serial Interface (TWSI)

### Library data of the parts
C594-C601 = GRM155R71E104KE14D: as C330-C361 on sheet 17_FE_PORT_17-24; Manufacturer Part Number: GRM155R71E104KE14D; RoHS: YES; Packaging: Reel; Package / Case: 0402; ComponentLink1URL: http://www.farnell.com/datasheets/4360.pdf; ComponentLink1Description: http://www.farnell.com/datasheets/4360.pdf; Pricing: 10000=0.008593, 30000=0.007991 (GBP); Supplier 1: Farnell; Supplier Part Number 1: 1118151; Stock: 3; Dielectric Characteristic: X7R; Operating Temperature Min: -55; Operating Temperature Max: 125; Operating Temperature Range: -55°C to +125; Series: GRM Hi-Cap; Terminal Type: Surface Mount (SMD, SMT); Tolerance -: 10%; Voltage Rating V DC: 16
DD39 = 98DX1035A1-BIH2C002: as DD39 on sheet 26_PP0_SSMII; Manufacturer Part Number: 98DX1035B0-BIH2C002
R691-R693 = ERJ-2RKF6041X: R0402, 6.04k 1%; Manufacturer: Panasonic; Rpart number: RC0402FR-076K04L ; RC1005F6041CS ; RMCF0402FT6K04 ; CRCW04026K04FKED ; TRR01MZPF6041 ; RC-02W6041FT; Rmanufacturer: Yageo  Samsung  Stackpole Electronics  Rohm Semiconductor  Vishay Dale; Customer Part Number: Резистор, 6K04, 0402, 1%; Description 1: RES 6.04K OHM 1/10W 1% 0402 SMD; Category 1: Resistors; Power (Watts): 0.1W, 1/10W; Temperature Coefficient: ±100ppm/°C; Analogs: any suitable; Tolerance: ±1%; Supplier 1: Digi-Key; Supplier Part Number 1: P6.04KLCT-ND; RoHS 1: RoHS Compliant; Stock 1: 566346; Pricing 1: 1=0.1, 50=0.0242, 100=0.0184, 250=0.01364, 500=0.01008, 1000=0.00672, 5000=0.00473 (USD); Composition: Thick Film; Features: -; Package / Case: 0402 (1005 Metric); Size / Dimension: 0.039" L x 0.020" W (1.00mm x 0.50mm); Height: 0.016" (0.40mm); Number of Terminations: 2; Packaging: Cut Tape (CT); ComponentLink1URL: http://industrial.panasonic.com/www-cgi/jvcr13pz.cgi?E+PZ+3+AOA0002+ERJ2RKF6041X+7+WW; ComponentLink1Description: http://industrial.panasonic.com/www-cgi/jvcr13pz.cgi?E+PZ+3+AOA0002+ERJ2RKF6041X+7+WW; RoHS: RoHS Compliant; Supplier Part Number: P6.04KLCT-ND; Category: Resistors; Supplier: Digi-Key; Pricing: 1=0.1, 50=0.0242, 100=0.0184, 250=0.01364, 500=0.01008, 1000=0.00672, 5000=0.00473 (USD); Manufacturer Part Number: ERJ-2RKF6041X
R700 R701 = ERJ-2RKF4751X: as R611-R614 on sheet 22_PHY_GE_PP1; Tolerance: ±1%; Packaging: Cut Tape (CT); Package / Case: 0402 (1005 Metric); Category: Resistors; Manufacturer Part Number: ERJ-2RKF4751X; Supplier Part Number: P4.75KLCT-ND; RoHS: RoHS Compliant; Supplier: Digi-Key; ComponentLink1URL: http://industrial.panasonic.com/www-cgi/jvcr13pz.cgi?E+PZ+3+AOA0002+ERJ2RKF4751X+7+WW; ComponentLink1Description: http://industrial.panasonic.com/www-cgi/jvcr13pz.cgi?E+PZ+3+AOA0002+ERJ2RKF4751X+7+WW; Features: -; Composition: Thick Film; Height: 0.016" (0.40mm); Number of Terminations: 2; Supplier Device Package: 0402; Size / Dimension: 0.039" L x 0.020" W (1.00mm x 0.50mm)